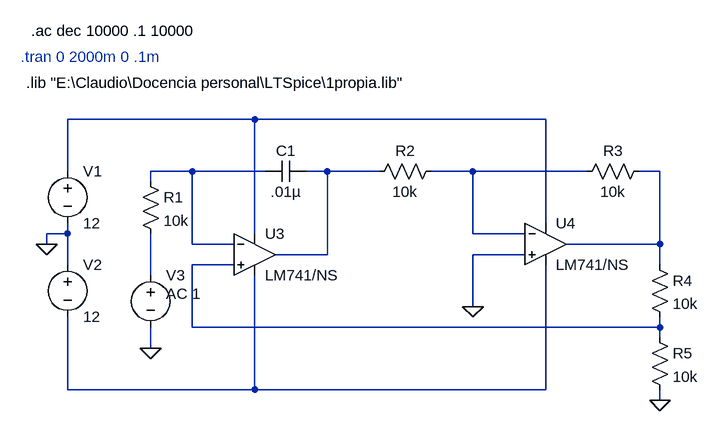
[diagram p0: schematic retardo.asc]
retardo.asc, the LTspice schematic file:
Version 4
SHEET 1 1028 680
WIRE 208 0 -80 0
WIRE 656 0 208 0
WIRE -80 80 -80 0
WIRE 112 80 48 80
WIRE 224 80 112 80
WIRE 320 80 288 80
WIRE 400 80 320 80
WIRE 544 80 480 80
WIRE 720 80 544 80
WIRE 832 80 800 80
WIRE 48 96 48 80
WIRE 656 160 656 0
WIRE -80 176 -80 160
WIRE -80 176 -112 176
WIRE 208 176 208 0
WIRE 544 176 544 80
WIRE 624 176 544 176
WIRE -112 192 -112 176
WIRE 112 192 112 80
WIRE 176 192 112 192
WIRE 832 192 832 80
WIRE 832 192 688 192
WIRE 320 208 320 80
WIRE 320 208 240 208
WIRE 624 208 544 208
WIRE -80 224 -80 176
WIRE 176 224 112 224
WIRE 832 224 832 192
WIRE 48 240 48 176
WIRE 544 288 544 208
WIRE 112 320 112 224
WIRE 832 320 832 304
WIRE 832 320 112 320
WIRE 832 336 832 320
WIRE 48 352 48 320
WIRE -80 416 -80 304
WIRE 208 416 208 240
WIRE 208 416 -80 416
WIRE 656 416 656 224
WIRE 656 416 208 416
WIRE 832 432 832 416
FLAG -112 192 0
FLAG 544 288 0
FLAG 832 432 0
FLAG 48 352 0
SYMBOL voltage -80 64 R0
WINDOW 123 0 0 Left 2
WINDOW 39 0 0 Left 2
SYMATTR InstName V1
SYMATTR Value 12
SYMBOL voltage -80 208 R0
WINDOW 123 0 0 Left 2
WINDOW 39 0 0 Left 2
SYMATTR InstName V2
SYMATTR Value 12
SYMBOL cap 288 64 R90
WINDOW 0 0 32 VBottom 2
WINDOW 3 32 32 VTop 2
SYMATTR InstName C1
SYMATTR Value .01µ
SYMBOL res 32 80 R0
SYMATTR InstName R1
SYMATTR Value 10k
SYMBOL res 496 64 R90
WINDOW 0 0 56 VBottom 2
WINDOW 3 32 56 VTop 2
SYMATTR InstName R2
SYMATTR Value 10k
SYMBOL res 816 64 R90
WINDOW 0 0 56 VBottom 2
WINDOW 3 32 56 VTop 2
SYMATTR InstName R3
SYMATTR Value 10k
SYMBOL res 816 208 R0
SYMATTR InstName R4
SYMATTR Value 10k
SYMBOL res 816 320 R0
SYMATTR InstName R5
SYMATTR Value 10k
SYMBOL voltage 48 224 R0
WINDOW 3 24 96 Invisible 2
WINDOW 123 24 44 Left 2
WINDOW 39 0 0 Left 2
SYMATTR Value PULSE(-2 2 0 1u 1u 500m 1000m)
SYMATTR Value2 AC 1
SYMATTR InstName V3
SYMBOL OpAmps\\opamp2 208 144 R0
SYMATTR InstName U3
SYMATTR Value LM741/NS
SYMBOL OpAmps\\opamp2 656 128 R0
SYMATTR InstName U4
SYMATTR Value LM741/NS
TEXT -152 -96 Left 2 ;.tran 0 2000m 0 .1m
TEXT -144 -56 Left 2 !.lib "E:\\Claudio\\Docencia personal\\LTSpice\\1propia.lib"
TEXT -136 -136 Left 2 !.ac dec 10000 .1 10000

The netlist it stands for:
* retardo.asc
V1 N001 0 12
V2 0 N008 12
C1 N003 N002 .01µ
R1 N002 N007 10k
R2 N004 N003 10k
R3 N005 N004 10k
R4 N005 N006 10k
R5 N006 0 10k
V3 N007 0 PULSE(-2 2 0 1u 1u 500m 1000m) AC 1
XU3 N006 N002 N001 N008 N003 LM741/NS  ; pins In+ In- V+ V- OUT
XU4 0 N004 N001 N008 N005 LM741/NS  ; pins In+ In- V+ V- OUT
* .tran 0 2000m 0 .1m
.lib "E:\Claudio\Docencia personal\LTSpice\1propia.lib"
.ac dec 10000 .1 10000
.backanno
.end